# EAGLE design revision (EAGLE 7.2.0)
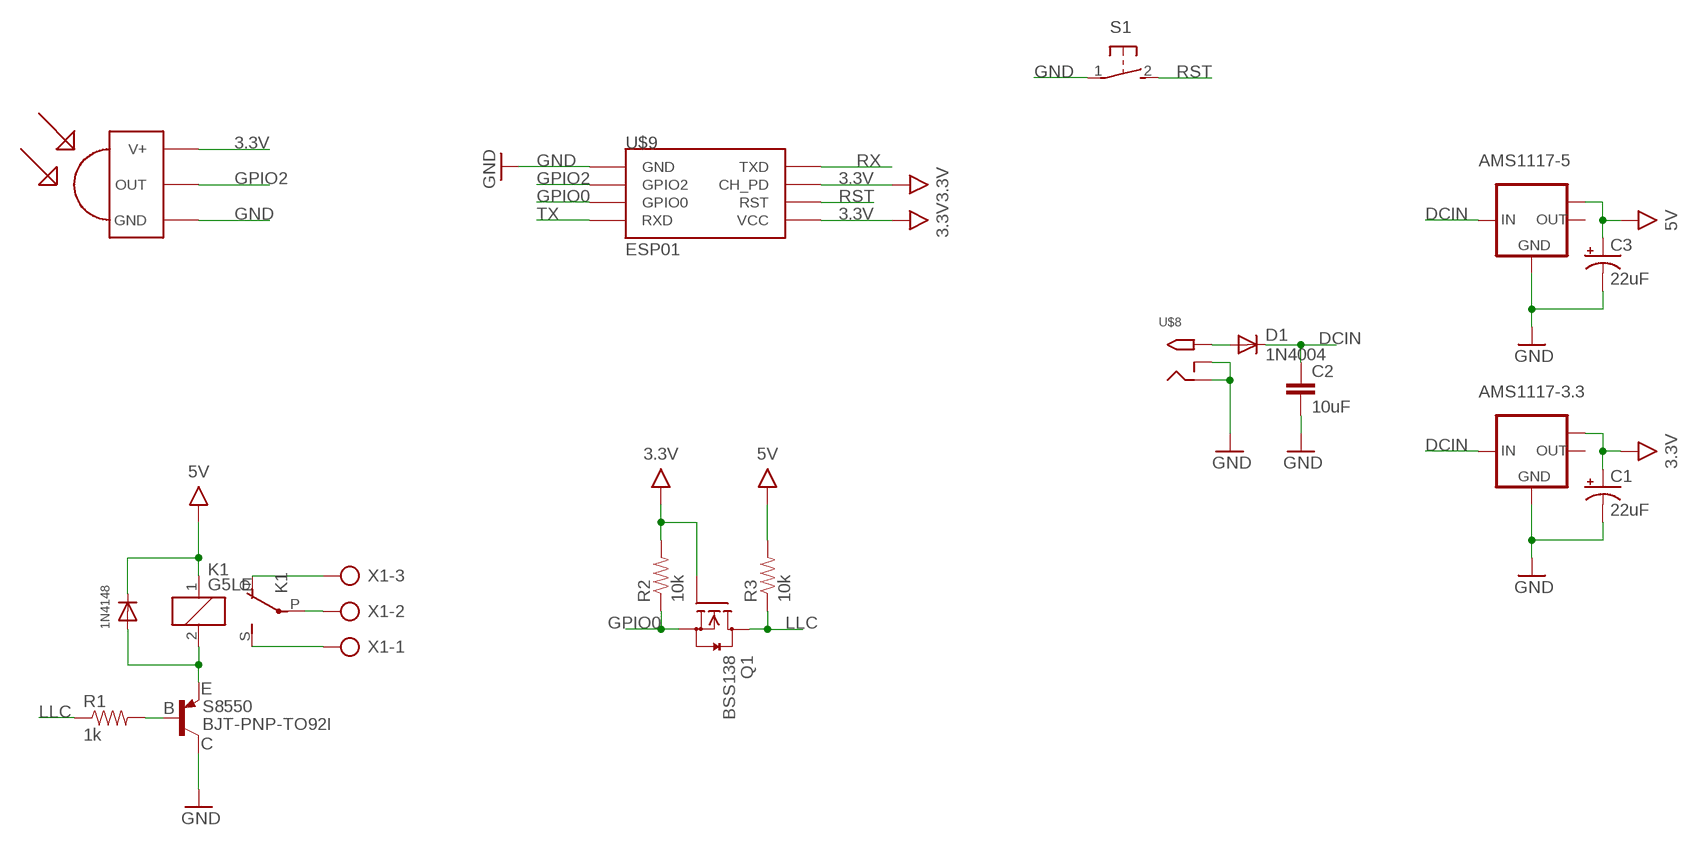
[diagram p0: schematic, sheet 1]

## Parts
1N4148  DIODESOD-123  [SOD-123]
AMS1117-3.3  LM1117MPX-3.3  [SOT223]
AMS1117-5  LM1117MPX-3.3  [SOT223]
C1  22uF  CAP_POL1206-KIT  [EIA3216-KIT]
C2  10uF  CAP0805  [0805]
C3  22uF  CAP_POL1206-KIT  [EIA3216-KIT]
D1  1N4004  [DO41-10]
K1  G5LE  [G5LE]
Q1  BSS138  [SOT23]
R1  1k  RESISTOR0805-RES  [0805]
R2  10k  RESISTOR0805-RES  [0805]
R3  10k  RESISTOR0805-RES  [0805]
S1  31-XX  [B3F-31XX]
S8550  BJT-PNP-TO92I  [TO92I]
U$8  2.1MMJACKTHM  [PJ-102A]
U$9  ESP01  [ESP01]
U$10  TSOP1736  [TSOP17XX]
X1  AK300/3  [AK300/3]

## Nets
3.3V [power]: AMS1117-3.3.TAB(OUT1) C1.A(+) Q1.1(G) R2.2 U$9.CH_PD U$9.VCC U$10.V+
5V [power]: 1N4148.C AMS1117-5.TAB(OUT1) C3.A(+) K1.1 R3.2
DCIN [power]: AMS1117-3.3.3(IN) AMS1117-5.3(IN) C2.1 D1.C
GND: AMS1117-3.3.1(GND) AMS1117-5.1(GND) C1.C(-) C2.2 C3.C(-) S1.1(P) S8550.C U$8.RING U$8.RING_SW U$9.GND U$10.GND
GPIO0: Q1.2(S) R2.1 U$9.GPIO0
GPIO2: U$9.GPIO2 U$10.OUT
LLC: Q1.3(D) R1.1 R3.1
N$2: R1.2 S8550.B
N$3: K1.O(2:O) X1.3
N$4: K1.P(2:P) X1.2
N$5: K1.S(2:S) X1.1
N$8: D1.A U$8.TIP
N$15 [power]: 1N4148.A K1.2 S8550.E
RST: S1.2(S) U$9.RST
RX: U$9.TX(TXD)
TX: U$9.RX(RXD)
Unconnected: AMS1117-3.3.2(OUT) AMS1117-5.2(OUT)

## Library data of the parts
1N4148 = adafruit:DIODE: Diode SMADIODE - SMA Surface Mount Package 20V 1A Schottky Diode Digikey: 641-1014-6-ND DO-1N4148 - Through Hole Small Current Diode SOD-123 20V 1 A (.5mV Vf) Schottky Diode - Digikey: MBRX120TPMSCT-ND SOD-323 10V 570mA (.38mV Vf, 3ns) Schottky Diode - Digikey: ZLLS410CT-ND SOD-523 30V 30mA Schottky Diode (RB751S-40TE61) - Digikey: RB751S-40TE61CT-ND SOT23-R/W - SOT23 Package (R = Solder Paste/Reflow Ovens, W = Hand-Soldering) BAT54Film 40V 300mA - Digikey: 497-7162-1-ND
AMS1117-3.3 AMS1117-5 = lm1117:LM1117MPX-*
C1 C3 = SparkFun-Passives:CAP_POL: Capacitor Polarized These are standard SMD and PTH capacitors. Normally 10uF, 47uF, and 100uF in electrolytic and tantalum varieties. Always verify the external diameter of the through hole cap, it varies with capacity, voltage, and manufacturer. The EIA devices should be standard.
C2 = SparkFun-Passives:CAP: Capacitor Standard 0603 ceramic capacitor, and 0.1" leaded capacitor.
D1 = adafruit:1N4004: DIODE General purpose 1N400x type rectifier (With bigger pads) http://www.ladyada.net/library/pcb/eaglelibrary.html
K1 = relay:G5LE: RELAY 1 x switch, 10 A/120 V AC, 8 A/30 V DC, Omron; OC_FARNELL: unknown; OC_NEWARK: unknown
Q1 = m-pad-2.1:BSS138: Fairchild Semiconductors BSS138 N-Channel Logic Level Enhancement Mode Field Effect Transistor General Description: These N-Channel enhancement mode field effect transistors are produced using Fairchild's proprietary, high cell density, DMOS technology. These products have been designed to minimize on-state resistance while provide rugged, reliable, and fast switching performance.These products are particularly suited for low voltage, low current applications such as small servo motor control, power MOSFET gate drivers, and other switching applications. Features: 0.22 A, 50 V. RDS(ON) = 3.5Ohm @ VGS = 10 V RDS(ON) = 6.0Ohm @ VGS = 4.5 V High density cell design for extremely low RDS(ON) Rugged and Reliable Compact industry standard SOT-23 surface mount package Please send any comments to: messi@users.sourceforge.net
R1-R3 = SparkFun-Passives:RESISTOR: Resistor Basic schematic elements and footprints for 0603, 1206, and PTH resistors.
S1 = switch-omron:31-XX: OMRON SWITCH; MPN: B3F-3100; OC_FARNELL: 959704; OC_NEWARK: 36M3582
S8550 = bt_transistor:BJT-PNP: PNP Transistor Small signal PNP Bipolar Junction Transistor (BJT). Use this device to represent any of a number of such transistors with similar package and pinout: 2N4402, 2N3906, etc.
U$8 = adafruit:2.1MMJACK: 2.1mm x 5.5mm THM DC jack with internal switch. Digikey part #PJ-102A, 4UCON part #05537 2.1mm x 5.5mm SMT DC jack with internal switch. Digikey part #PJ-002A-SMT, 4UCON part #03267 By microbuilder.eu & adafruit.com
U$9 = esp8266modules:ESP01: ESP8266 Wifi module 01
U$10 = tsop:TSOP1736: IR Receiver and Demodulator
X1 = con-ptr500:AK300/3: CONNECTOR; OC_FARNELL: unknown; OC_NEWARK: unknown

## Net classes
0 default: width 0.61 mm, clearance 0.762 mm
1 power: width 1.27 mm, clearance 0.762 mm

## Board
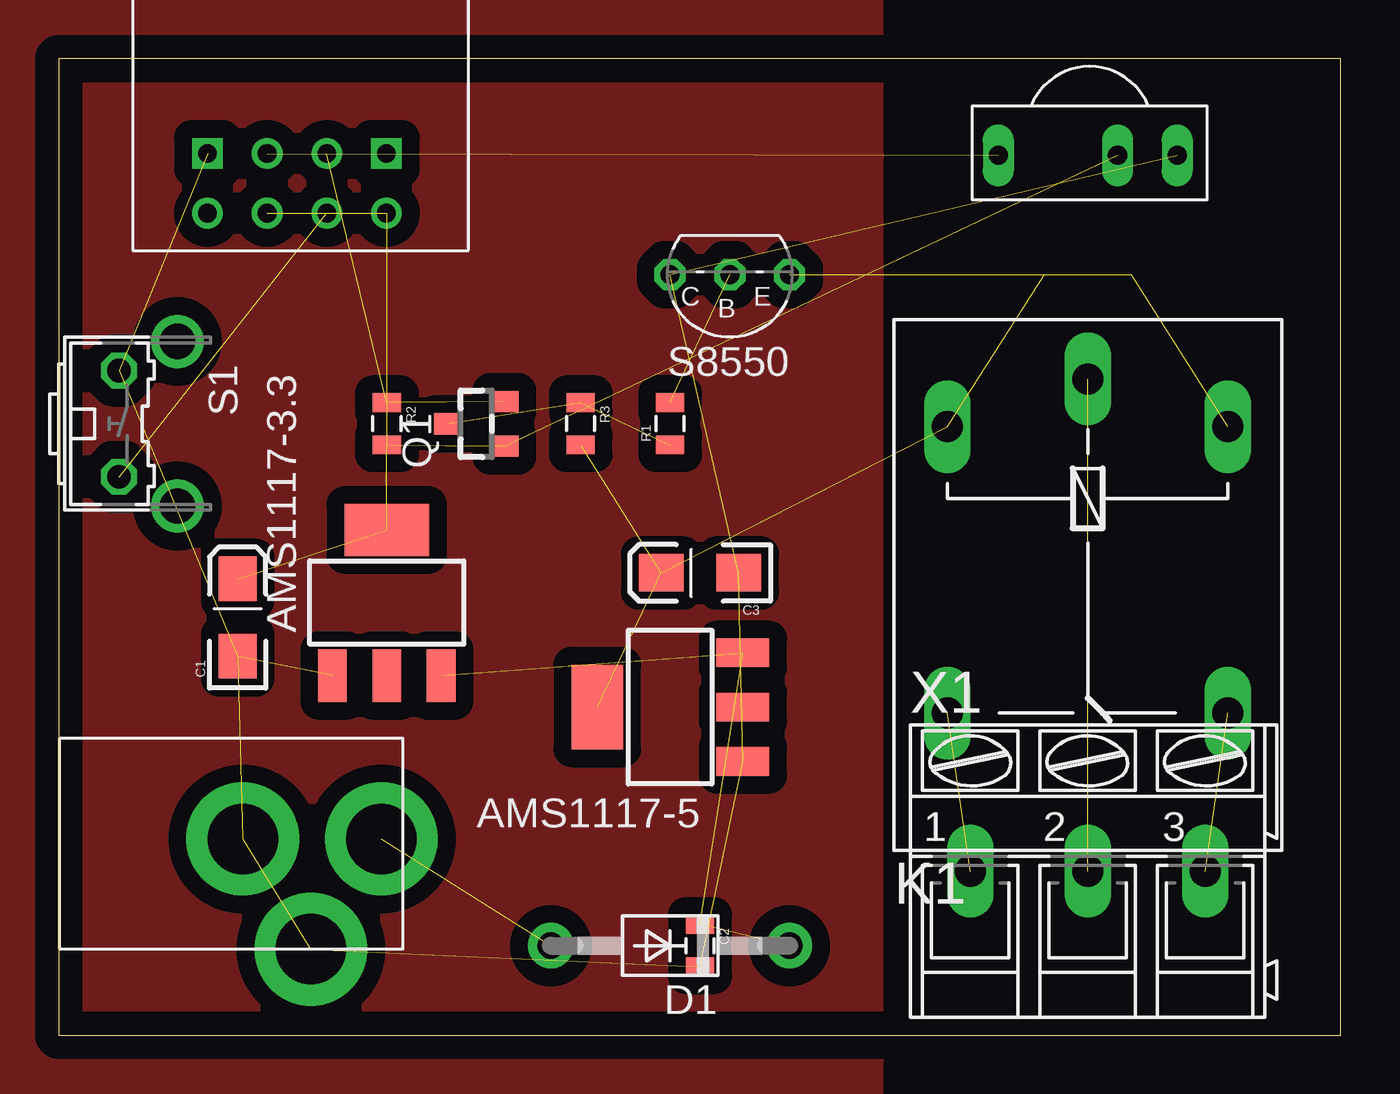
[diagram p1: board, top side]
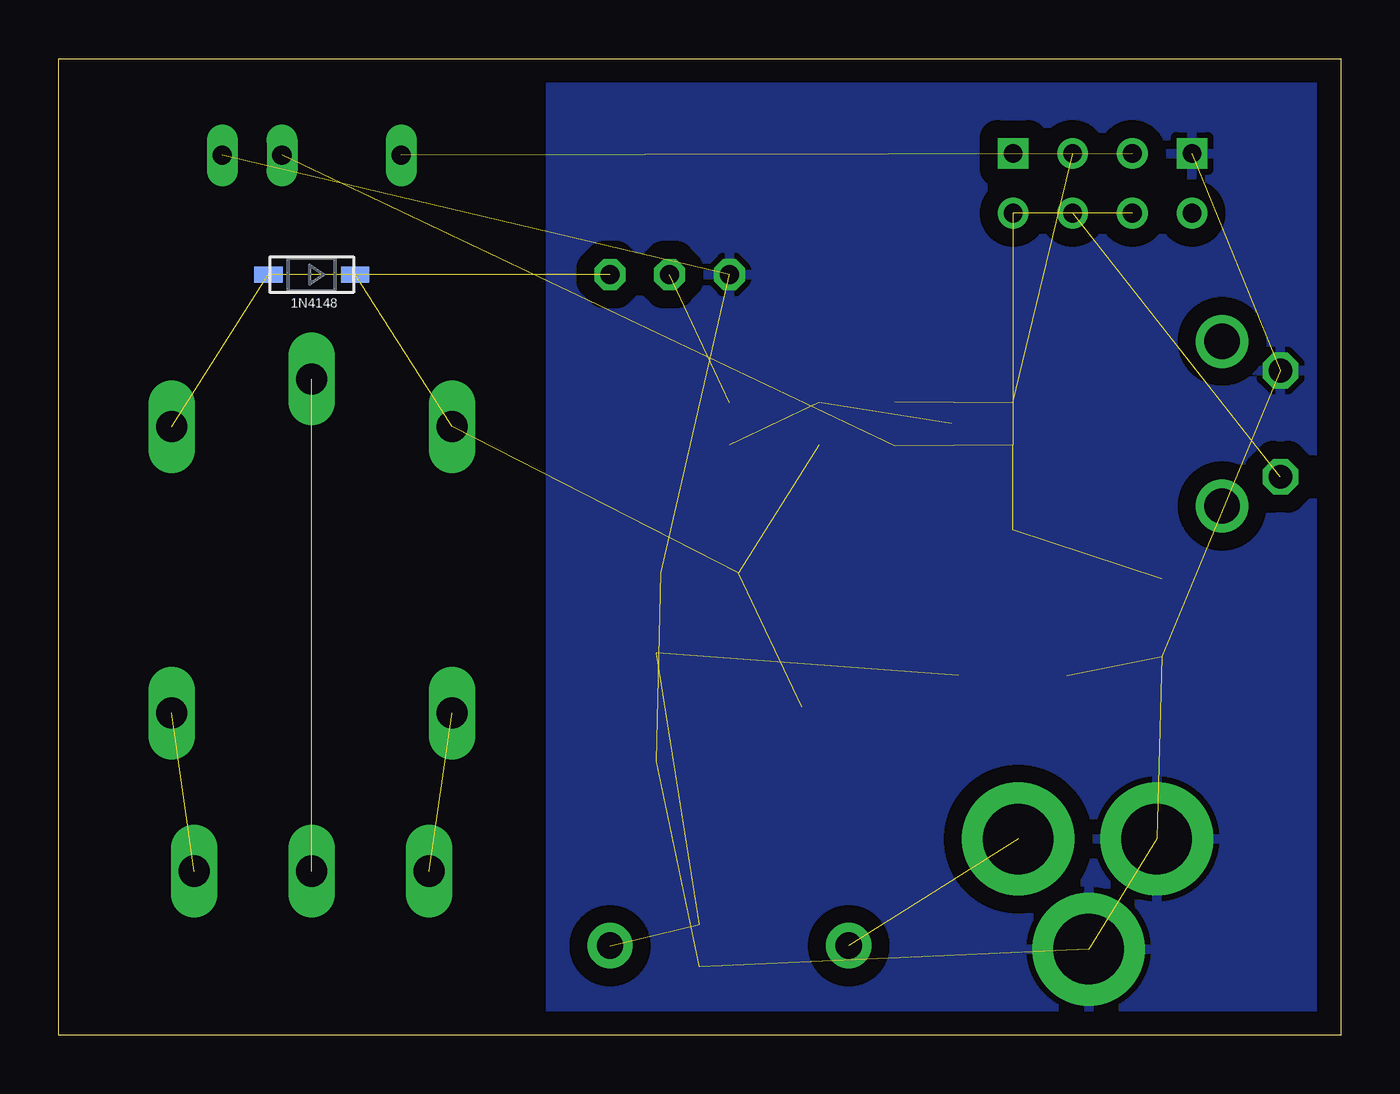
[diagram p2: board, bottom side, seen from below]

Size 54.59 x 41.58 mm. Coordinates in mm from the lower left corner, seen from the top.
Outline: 0,0 54.59,0 54.59,41.58 0,41.58 0,0
Copper layers (1*16): Top 0.035mm / dielectric 1.5mm / Bottom 0.035mm
Design rules "default": minimum track width 10mil, minimum drill 24mil, track to track 8mil, track to pad 8mil, pad to pad 8mil, via to via 8mil, smd to smd 8mil, copper to edge 40mil, drill to drill 8mil, minimum pad ring 10mil, minimum via ring 8mil, stop-mask expansion 4mil, vias tented up to drill 0mil, thermal gap 10mil

### Footprints (pad centres in the part's own frame; a part is rotated, then mirrored left to right if it is on the bottom)
SOD-123 = smd 1.2 x 0.7: A 1.85,0; C -1.85,0
SOT223 = smd 1.219 x 2.235: 1 -2.311,-3.099; 2 0,-3.099; 3 2.311,-3.099 | smd 3.6 x 2.2: TAB 0,3.099
EIA3216-KIT = smd 1.9 x 1.6: A 1.65,0; C -1.65,0
0805 = smd 0.8 x 1.2: 1 -0.9,0; 2 0.9,0
DO41-10 = drill 1.118 pad 1.93: A 5.08,0; C -5.08,0
G5LE = drill 1.321 long: 1 -7.493,-5.969; 2 -7.493,5.969; O 4.699,5.969; P -9.525,0; S 4.699,-5.969
SOT23 = smd 0.9 x 1.2: 1 -0.95,-1.2; 2 0.95,-1.2; 3 0,1.2
B3F-31XX = drill 1.016 octagon: 1 -2.261,-1.245; 2 2.261,-1.245 | drill 1.499 pad 2.159: 3 -3.505,1.245; 4 3.505,1.245
TO92I = drill 0.813 octagon: B 0,0; C 2.54,0; E -2.54,0
PJ-102A = drill 3 pad 4.8: RING 0.1,-3.39; RING_SW -4.6,-6.29; TIP 0.1,-9.29
ESP01 = drill 0.8: CH_PD -1.285,-8.178; GPIO0 1.255,-5.638; GPIO2 -1.285,-5.638; RST 1.255,-8.178; TX -3.825,-8.178; VCC 3.795,-8.178 | drill 0.8 square: GND -3.825,-5.638; RX 3.795,-5.638
TSOP17XX = drill 0.813 long: GND -3.81,0; OUT 3.81,0; V+ -1.27,0
AK300/3 = drill 1.321 long: 1 -5.004,0; 2 0,0; 3 5.004,0

### Placement (x,y rotation side)
1N4148  43.82,32.39 180 bottom
AMS1117-3.3  13.97,18.41 0 top
AMS1117-5  26.03,13.97 90 top
C1  7.62,17.78 90 top
C2  27.3,3.81 270 top
C3  27.3,19.69 180 top
D1  26.03,3.81 180 top
K1  43.82,18.41 270 top
Q1  17.78,26.04 90 top
R1  26.03,26.04 90 top
R2  13.97,26.04 270 top
R3  22.23,26.04 270 top
S1  3.81,26.04 270 top
S8550  28.57,32.39 180 top
U$8  4.45,8.26 90 top
U$9  10.16,43.18 0 top
U$10  43.82,37.47 180 top
X1  43.82,6.99 0 top

### Tracks (layer width: path | path; a pad name or v marks a point on that pad's centre or on a via)
3.3V  (6 unrouted)
5V  (4 unrouted)
DCIN  (3 unrouted)
GND  (10 unrouted)
  pour Bottom: -1.91,45.09 33.65,45.09 33.65,-3.17 -1.91,-3.17
GPIO0  (2 unrouted)
GPIO2  (1 unrouted)
LLC  (2 unrouted)
N$1
  pour Top: -3.17,-3.17 -3.17,-4.45 34.93,-4.45 34.93,46.35 -3.17,46.35
N$2  (1 unrouted)
N$3  (1 unrouted)
N$4  (1 unrouted)
N$5  (1 unrouted)
N$8  (1 unrouted)
N$11  (via drill 3.2)
  other vias: -12.07,45.09
N$12  (via drill 3.2)
  other vias: 64.13,45.09
N$13  (via drill 3.2)
  other vias: 66.68,1.91
N$14  (via drill 3.2)
  other vias: -12.07,3.18
N$15  (2 unrouted)
RST  (1 unrouted)
(copper drawn outside any net)
  shapes: Top area x1